# Altium schematic sheet Filtres Passe-Haut + Passe-Bas.SchDoc
size A4; SheetNumber: 3; SheetTotal: 3
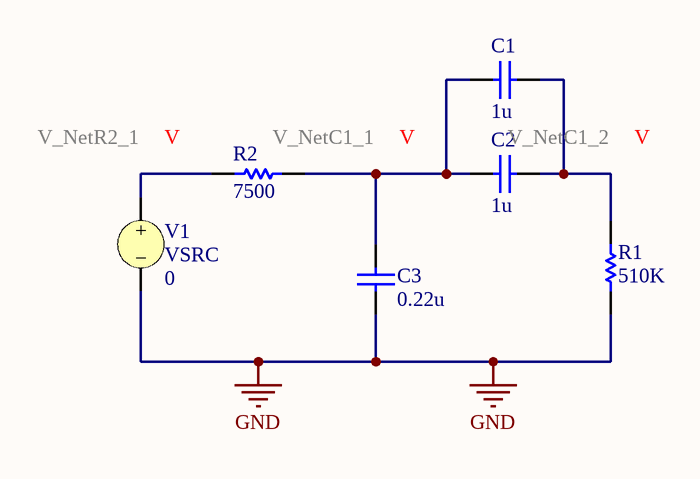
[diagram p0: Filtres Passe-Haut + Passe-Bas.SchDoc]

## Parts
C1  value 1u  (hidden comment: Capacitor)
C2  value 1u  (hidden comment: Capacitor)
C3  value 0.22u  (hidden comment: Capacitor)
R1  value 510K  (hidden comment: Resistor)
R2  value 7500  (hidden comment: Resistor)
V1  VSRC  DC Magnitude: 0

## Nets
GND: C3.1 R1.1 V1.2
NetC1_1: C1.1 C2.2 C3.2 R2.2
NetC1_2: C1.2 C2.1 R1.2
NetR2_1: R2.1 V1.1

## Library data of the parts
C1-C3 = Capacitor: SimulationGenericComponent: True
R1 R2 = Resistor: TC1: 0; SimulationGenericComponent: True; TC2: 0
V1 = VSRC: Voltage Source; Note: PCB Footprint - Not required; Amplitude: 3; Frequency: 10K; Published: 30-July-2020; LatestRevisionDate: 30-July-2020; LatestRevisionNote: Re-released for DXP Platform.; PackageReference: Not Applicable; Publisher: Altium Limited; AC Magnitude: 0; AC Phase: 0; Offset: 0; Delay: 0; Damping Factor: 0; Phase: 0